# Altium schematic sheet STM32F407VXX.SchDoc
size A3
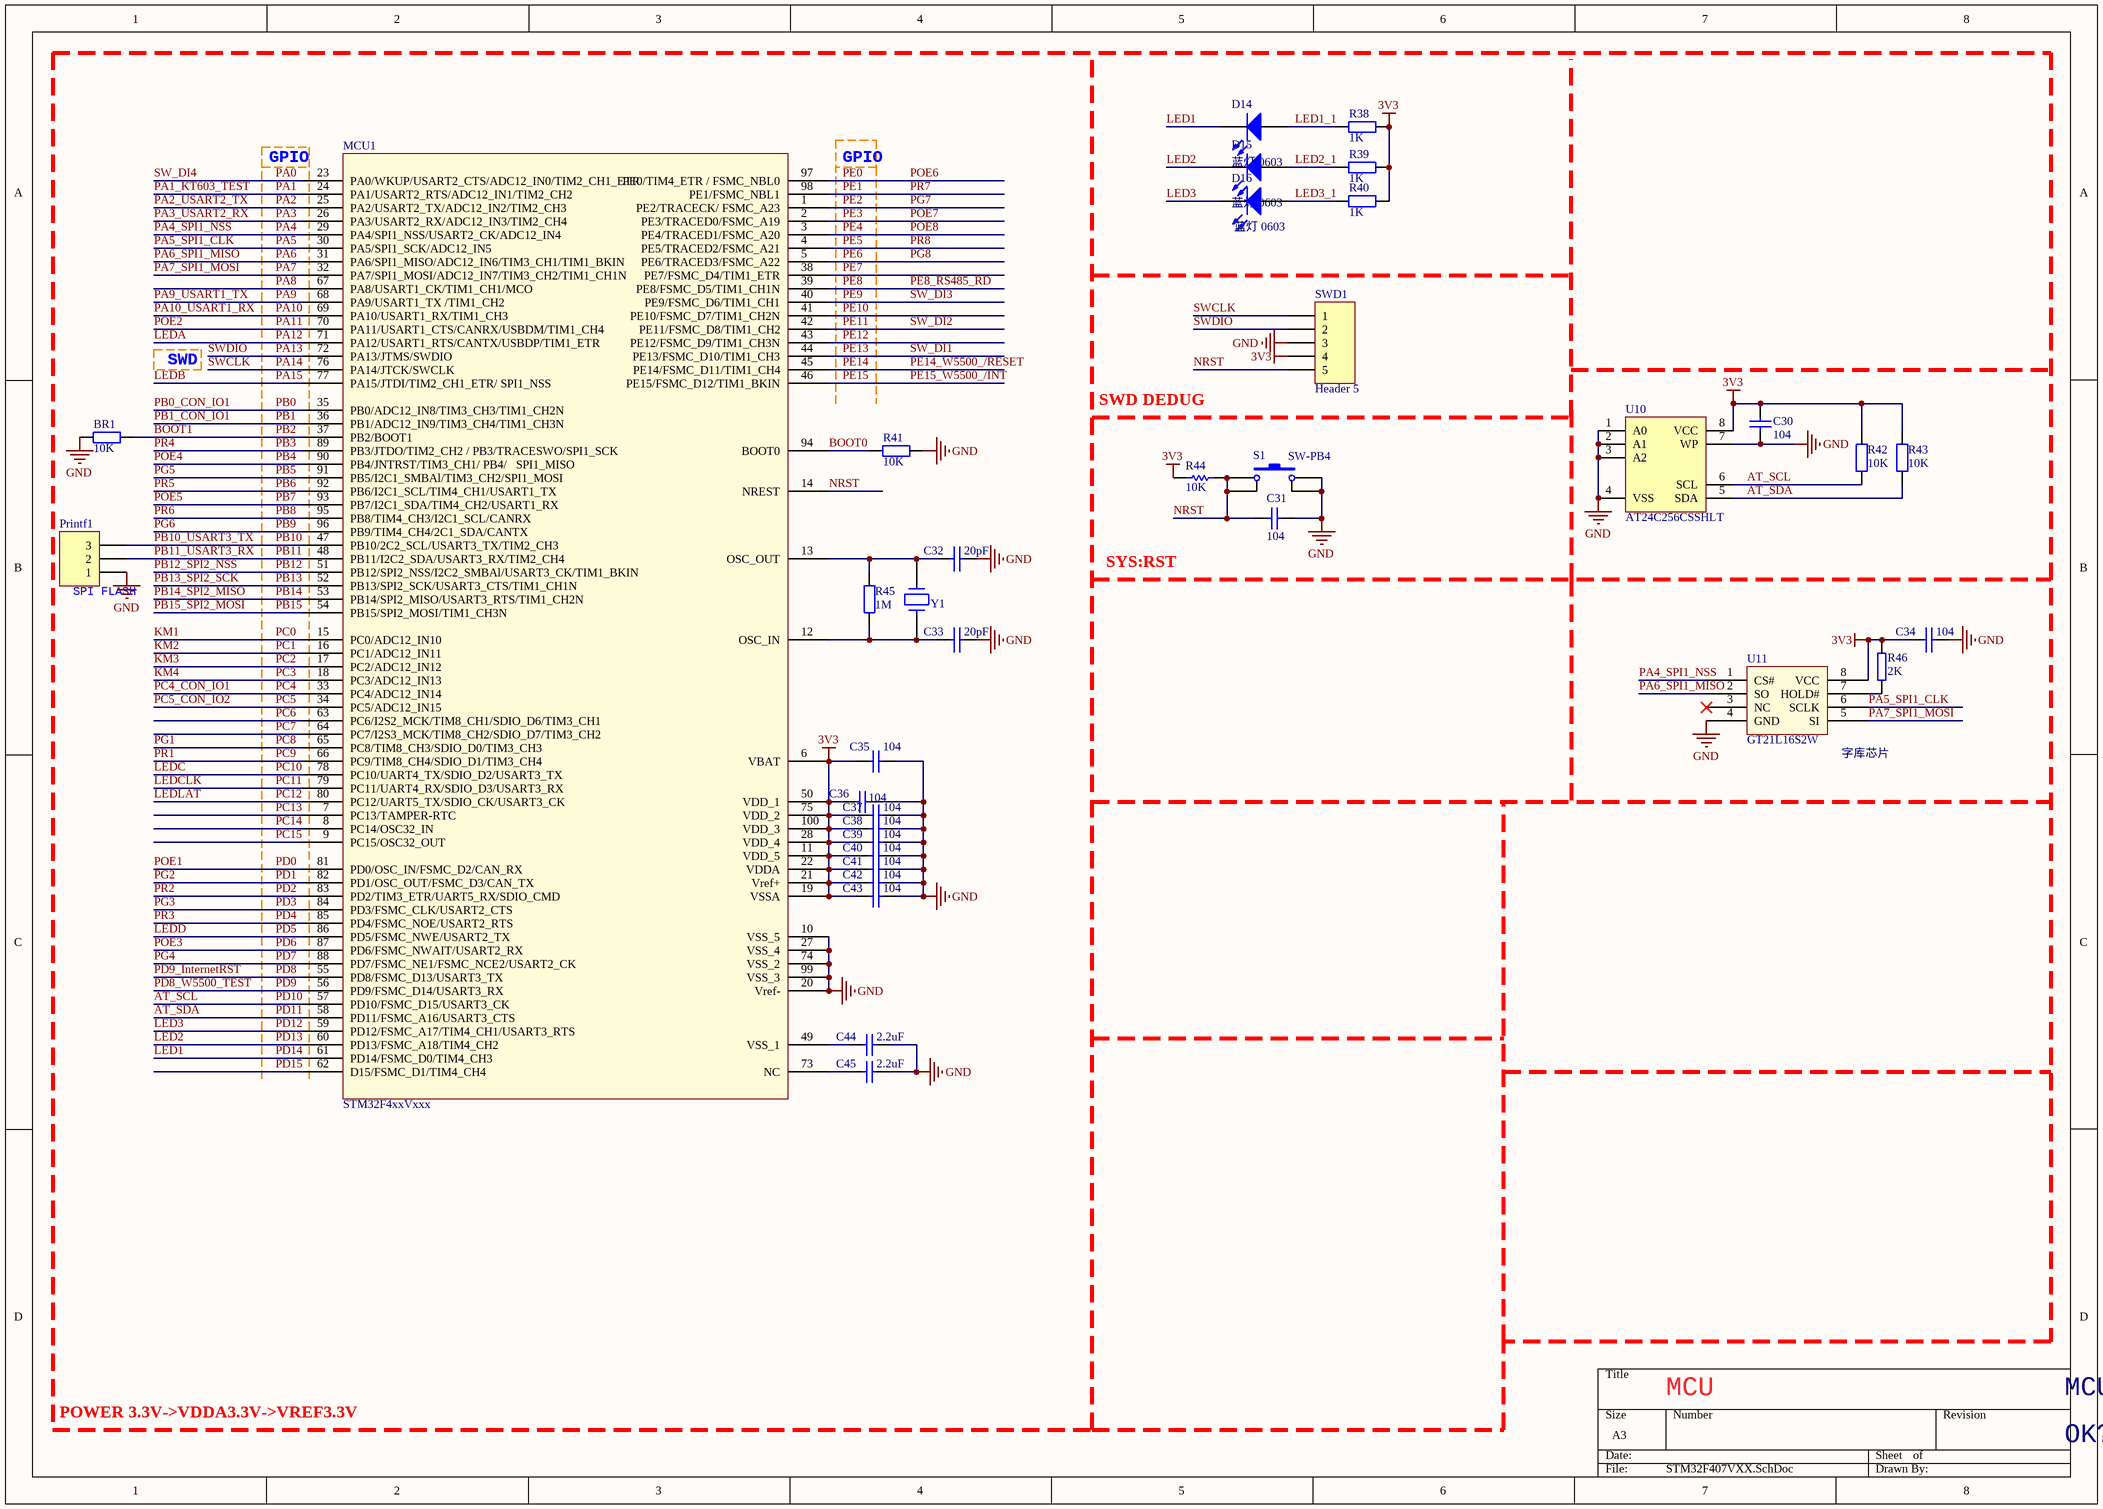
[diagram p0: STM32F407VXX.SchDoc]

## Parts
BR1  10K  [LC-0603_R]
C30  104  [LC-0603_C]
C31  104  [LC-0603_C]
C32  20pF  [LC-0603_C]
C33  20pF  [LC-0603_C]
C34  104  [LC-0603_C]
C35  104  [LC-0603_C]
C36  104  [LC-0603_C]
C37  104  [LC-0603_C]
C38  104  [LC-0603_C]
C39  104  [LC-0603_C]
C40  104  [LC-0603_C]
C41  104  [LC-0603_C]
C42  104  [LC-0603_C]
C43  104  [LC-0603_C]
C44  2.2uF  [LC-0603_C]
C45  2.2uF  [LC-0603_C]
D14  蓝灯 0603  [LC-0603_LED_S1]
D15  蓝灯 0603  [LC-0603_LED_S1]
D16  蓝灯 0603  [LC-0603_LED_S1]
MCU1  STM32F4xxVxxx  [LC-QFP-100_14x14x05P]
Printf1  Printf  [F2.54-3P]  (value not drawn)
R38  1K  [LC-0603_R]
R39  1K  [LC-0603_R]
R40  1K  [LC-0603_R]
R41  10K  [LC-0603_R]
R42  10K  [LC-0603_R]
R43  10K  [LC-0603_R]
R44  10K  [LC-0603_R]
R45  1M  [LC-0603_R]
R46  2K  [LC-0603_R]
S1  SW-PB4  [SW_PB4_A1]
SWD1  Header 5  [F2.54-5P]
U10  AT24C256CSSHLT  [SOIC-8]
U11  GT21L16S2W  [SOIC-8W]
Y1  25MHz  [LC-HC-49SMD]  (value not drawn)

## Nets
3V3: C30.1 C34.2 C35.1 C36.1 C37.1 C38.1 C39.1 C40.1 C41.1 C42.1 C43.1 MCU1.6(VBAT) MCU1.11(VDD_5) MCU1.19(VSSA) MCU1.21(Vref+) MCU1.22(VDDA) MCU1.28(VDD_4) MCU1.50(VDD_1) MCU1.75(VDD_2) MCU1.100(VDD_3) R38.1 R39.1 R40.1 R42.1 R43.1 R44.2 R46.1 SWD1.4 U10.8(VCC) U11.8(VCC)
GND: BR1.1 C30.2 C31.1 C32.2 C33.2 C34.1 C35.2 C36.2 C37.2 C38.2 C39.2 C40.2 C41.2 C42.2 C43.2 C44.2 C45.2 MCU1.10(VSS_5) MCU1.20(Vref-) MCU1.27(VSS_4) MCU1.74(VSS_2) MCU1.99(VSS_3) Printf1.1 R41.1 S1.2 S1.3 SWD1.3 U10.1(A0) U10.2(A1) U10.3(A2) U10.4(VSS) U10.7(WP) U11.4(GND)
AT_SCL: MCU1.57(PD10/FSMC_D15/USART3_CK) R42.2 U10.6(SCL)  [also labelled PD10]
AT_SDA: MCU1.58(PD11/FSMC_A16/USART3_CTS) R43.2 U10.5(SDA)  [also labelled PD11]
BOOT0: MCU1.94(BOOT0) R41.2
BOOT1: BR1.2 MCU1.37(PB2/BOOT1)  [also labelled PB2]
KM1: MCU1.15(PC0/ADC12_IN10)  [also labelled PC0]
KM2: MCU1.16(PC1/ADC12_IN11)  [also labelled PC1]
KM3: MCU1.17(PC2/ADC12_IN12)  [also labelled PC2]
KM4: MCU1.18(PC3/ADC12_IN13)  [also labelled PC3]
LED1: D14.K MCU1.61(PD14/FSMC_D0/TIM4_CH3)  [also labelled PD14]
LED1_1: D14.A R38.2
LED2: D15.K MCU1.60(PD13/FSMC_A18/TIM4_CH2)  [also labelled PD13]
LED2_1: D15.A R39.2
LED3: D16.K MCU1.59(PD12/FSMC_A17/TIM4_CH1/USART3_RTS)  [also labelled PD12]
LED3_1: D16.A R40.2
LEDA: MCU1.71(PA12/USART1_RTS/CANTX/USBDP/TIM1_ETR)  [also labelled PA12]
LEDB: MCU1.77(PA15/JTDI/TIM2_CH1_ETR/_SPI1_NSS)  [also labelled PA15]
LEDC: MCU1.78(PC10/UART4_TX/SDIO_D2/USART3_TX)  [also labelled PC10]
LEDCLK: MCU1.79(PC11/UART4_RX/SDIO_D3/USART3_RX)  [also labelled PC11]
LEDD: MCU1.86(PD5/FSMC_NWE/USART2_TX)  [also labelled PD5]
LEDLAT: MCU1.80(PC12/UART5_TX/SDIO_CK/USART3_CK)  [also labelled PC12]
NRST: C31.2 MCU1.14(NREST) R44.1 S1.1 S1.4 SWD1.5
PA0: MCU1.23(PA0/WKUP/USART2_CTS/ADC12_IN0/TIM2_CH1_ETR)  [also labelled SW_DI4]
PA1: MCU1.24(PA1/USART2_RTS/ADC12_IN1/TIM2_CH2)  [also labelled PA1_KT603_TEST]
PA2: MCU1.25(PA2/USART2_TX/ADC12_IN2/TIM2_CH3)  [also labelled PA2_USART2_TX]
PA3: MCU1.26(PA3/USART2_RX/ADC12_IN3/TIM2_CH4)  [also labelled PA3_USART2_RX]
PA4: MCU1.29(PA4/SPI1_NSS/USART2_CK/ADC12_IN4) U11.1(CS#)  [also labelled PA4_SPI1_NSS]
PA5: MCU1.30(PA5/SPI1_SCK/ADC12_IN5) U11.6(SCLK)  [also labelled PA5_SPI1_CLK]
PA6: MCU1.31(PA6/SPI1_MISO/ADC12_IN6/TIM3_CH1/TIM1_BKIN) U11.2(SO)  [also labelled PA6_SPI1_MISO]
PA7: MCU1.32(PA7/SPI1_MOSI/ADC12_IN7/TIM3_CH2/TIM1_CH1N) U11.5(SI)  [also labelled PA7_SPI1_MOSI]
PA8: MCU1.67(PA8/USART1_CK/TIM1_CH1/MCO)
PA9: MCU1.68(PA9/USART1_TX_/TIM1_CH2)  [also labelled PA9_USART1_TX]
PA10: MCU1.69(PA10/USART1_RX/TIM1_CH3)  [also labelled PA10_USART1_RX]
PA11: MCU1.70(PA11/USART1_CTS/CANRX/USBDM/TIM1_CH4)  [also labelled POE2]
PA13: MCU1.72(PA13/JTMS/SWDIO) SWD1.2  [also labelled SWDIO]
PA14: MCU1.76(PA14/JTCK/SWCLK) SWD1.1  [also labelled SWCLK]
PB0: MCU1.35(PB0/ADC12_IN8/TIM3_CH3/TIM1_CH2N)  [also labelled PB0_CON_IO1]
PB1: MCU1.36(PB1/ADC12_IN9/TIM3_CH4/TIM1_CH3N)  [also labelled PB1_CON_IO1]
PB3: MCU1.89(PB3/JTDO/TIM2_CH2_/_PB3/TRACESWO/SPI1_SCK)  [also labelled PR4]
PB4: MCU1.90(PB4/JNTRST/TIM3_CH1/_PB4/___SPI1_MISO)  [also labelled POE4]
PB5: MCU1.91(PB5/I2C1_SMBAl/TIM3_CH2/SPI1_MOSI)  [also labelled PG5]
PB6: MCU1.92(PB6/I2C1_SCL/TIM4_CH1/USART1_TX)  [also labelled PR5]
PB7: MCU1.93(PB7/I2C1_SDA/TIM4_CH2/USART1_RX)  [also labelled POE5]
PB8: MCU1.95(PB8/TIM4_CH3/I2C1_SCL/CANRX)  [also labelled PR6]
PB9: MCU1.96(PB9/TIM4_CH4/2C1_SDA/CANTX)  [also labelled PG6]
PB10: MCU1.47(PB10/2C2_SCL/USART3_TX/TIM2_CH3) Printf1.3  [also labelled PB10_USART3_TX]
PB11: MCU1.48(PB11/I2C2_SDA/USART3_RX/TIM2_CH4) Printf1.2  [also labelled PB11_USART3_RX]
PB12: MCU1.51(PB12/SPI2_NSS/I2C2_SMBAl/USART3_CK/TIM1_BKIN)  [also labelled PB12_SPI2_NSS]
PB13: MCU1.52(PB13/SPI2_SCK/USART3_CTS/TIM1_CH1N)  [also labelled PB13_SPI2_SCK]
PB14: MCU1.53(PB14/SPI2_MISO/USART3_RTS/TIM1_CH2N)  [also labelled PB14_SPI2_MISO]
PB15: MCU1.54(PB15/SPI2_MOSI/TIM1_CH3N)  [also labelled PB15_SPI2_MOSI]
PC4: MCU1.33(PC4/ADC12_IN14)  [also labelled PC4_CON_IO1]
PC5: MCU1.34(PC5/ADC12_IN15)  [also labelled PC5_CON_IO2]
PC6: MCU1.63(PC6/I2S2_MCK/TIM8_CH1/SDIO_D6/TIM3_CH1)
PC7: MCU1.64(PC7/I2S3_MCK/TIM8_CH2/SDIO_D7/TIM3_CH2)
PC8: MCU1.65(PC8/TIM8_CH3/SDIO_D0/TIM3_CH3)  [also labelled PG1]
PC9: MCU1.66(PC9/TIM8_CH4/SDIO_D1/TIM3_CH4)  [also labelled PR1]
PC13: MCU1.7(PC13/TAMPER-RTC)
PC14: MCU1.8(PC14/OSC32_IN)
PC15: MCU1.9(PC15/OSC32_OUT)
PD0: MCU1.81(PD0/OSC_IN/FSMC_D2/CAN_RX)  [also labelled POE1]
PD1: MCU1.82(PD1/OSC_OUT/FSMC_D3/CAN_TX)  [also labelled PG2]
PD2: MCU1.83(PD2/TIM3_ETR/UART5_RX/SDIO_CMD)  [also labelled PR2]
PD3: MCU1.84(PD3/FSMC_CLK/USART2_CTS)  [also labelled PG3]
PD4: MCU1.85(PD4/FSMC_NOE/USART2_RTS)  [also labelled PR3]
PD6: MCU1.87(PD6/FSMC_NWAIT/USART2_RX)  [also labelled POE3]
PD7: MCU1.88(PD7/FSMC_NE1/FSMC_NCE2/USART2_CK)  [also labelled PG4]
PD8: MCU1.55(PD8/FSMC_D13/USART3_TX)  [also labelled PD9_InternetRST]
PD8_W5500_TEST: MCU1.56(PD9/FSMC_D14/USART3_RX)  [also labelled PD9]
PD15: MCU1.62(D15/FSMC_D1/TIM4_CH4)
PE0: MCU1.97(PE0/TIM4_ETR_/_FSMC_NBL0)  [also labelled POE6]
PE1: MCU1.98(PE1/FSMC_NBL1)  [also labelled PR7]
PE2: MCU1.1(PE2/TRACECK/_FSMC_A23)  [also labelled PG7]
PE3: MCU1.2(PE3/TRACED0/FSMC_A19)  [also labelled POE7]
PE4: MCU1.3(PE4/TRACED1/FSMC_A20)  [also labelled POE8]
PE5: MCU1.4(PE5/TRACED2/FSMC_A21)  [also labelled PR8]
PE6: MCU1.5(PE6/TRACED3/FSMC_A22)  [also labelled PG8]
PE7: MCU1.38(PE7/FSMC_D4/TIM1_ETR)
PE8: MCU1.39(PE8/FSMC_D5/TIM1_CH1N)  [also labelled PE8_RS485_RD]
PE9: MCU1.40(PE9/FSMC_D6/TIM1_CH1)  [also labelled SW_DI3]
PE10: MCU1.41(PE10/FSMC_D7/TIM1_CH2N)
PE11: MCU1.42(PE11/FSMC_D8/TIM1_CH2)  [also labelled SW_DI2]
PE12: MCU1.43(PE12/FSMC_D9/TIM1_CH3N)
PE13: MCU1.44(PE13/FSMC_D10/TIM1_CH3)  [also labelled SW_DI1]
PE14: MCU1.45(PE14/FSMC_D11/TIM1_CH4)  [also labelled PE14_W5500_/RESET]
PE15: MCU1.46(PE15/FSMC_D12/TIM1_BKIN)  [also labelled PE15_W5500_/INT]
NetC32_1: C32.1 MCU1.13(OSC_OUT) R45.2 Y1.2
NetC33_1: C33.1 MCU1.12(OSC_IN) R45.1 Y1.1
NetC44_1: C44.1 MCU1.49(VSS_1)
NetC45_1: C45.1 MCU1.73(NC)
NetR46_2: R46.2 U11.7(HOLD#)

Not connected (* = marked no-connect by the designer): U11 3(NC)*

## Notes on the sheet
- (near MCU1) GPIO
- GPIO
- SWD
- SWD DEDUG
- SYS:RST
- (near Printf1) SPI FLASH
- (near U11) 字库芯片
- MCU
- MCU板
- POWER 3.3V->VDDA3.3V->VREF3.3V
- OK?V1.0.0

## Library data of the parts
BR1 R38-R43 R45 = Res2: Resistor; Published: 8-Jun-2000; LatestRevisionDate: 17-Jul-2002; LatestRevisionNote: Re-released for DXP Platform.; PackageReference: AXIAL-0.4; Publisher: Altium Limited
  BR1 R41-R43: Value: 10K
  R38-R40: Value: 1K
  R45: Value: 1M
C30 C31 C35-C43 = CAP: Capacitor; Value: 100nF; Published: 8-Jun-2000; Revision: July-2002: Re-released for DXP Platform.; Publisher: Altium Limited
C32 C33 C44 C45 = CAP: Capacitor
  C44 C45: Published: 8-Jun-2000; Revision: July-2002: Re-released for DXP Platform.; Publisher: Altium Limited; Value: 2.2uF
C34 = C
D14-D16 = 0603 蓝灯: 发光二极管; ComponentLink1Description: 供应商链接; ComponentLink1URL: http://www.szlcsc.com/product/details_73150.html; Package: 0603; Supplier: LC; SuppliersPartNumber: C72041
MCU1 = STM32F103VET6
Printf1 = Header 3H: Header, 3-Pin, Right Angle; LatestRevisionDate: 17-Jul-2002; LatestRevisionNote: Re-released for DXP Platform.; Publisher: Altium Limited
R44 = res1: Resistor; Published: 8-Jun-2000; Revision: July-2002: Re-released for DXP Platform.; Publisher: Altium Limited; Value: 10K
R46 = RES2
S1 = SW-PB4: 微动开关; Published: 24-Mar-1999; LatestRevisionDate: 17-Jul-2002; LatestRevisionNote: Re-released for DXP Platform.; PackageReference: SPST-2; Publisher: Altium Limited
SWD1 = Header 5: Header, 5-Pin; LatestRevisionDate: 17-Jul-2002; LatestRevisionNote: Re-released for DXP Platform.; Publisher: Altium Limited
U10 = AT2: EEROM存储器
U11 = GT21L16S
Y1 = CRYSTAL